# Altium project STM32U575-refrence.PrjPcb
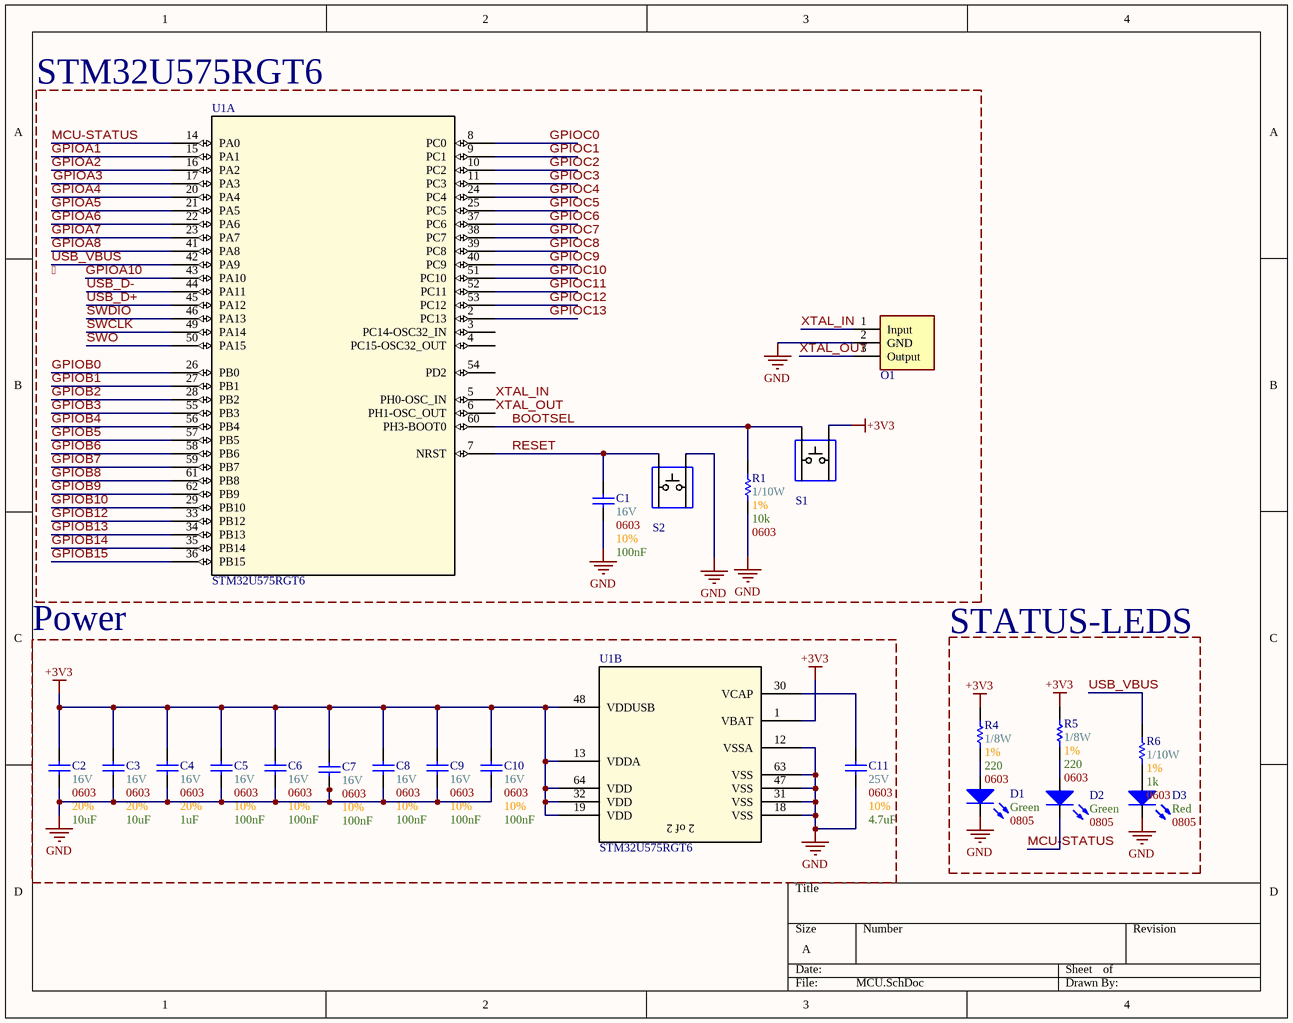
[diagram p0: MCU.SchDoc]
2 sheets, 32 parts. Net scope: global (net labels, ports and power ports of the same name join across sheets).
Board file: STM32 refrence board.PcbDoc
Sheets:
  MCU.SchDoc
  Connectors.SchDoc

## Sheet MCU.SchDoc
size A; SheetNumber: 1; SheetTotal: 2

### Parts
C1  Max Voltage: 16V  Size Package: 0603  Tolerance: 10%  Capacitance: 100nF  [[Cap] SMD 0603]  (hidden comment: [Cap] 0603 0.1uF 10% 16V)
C2  Max Voltage: 16V  Size Package: 0603  Tolerance: 20%  Capacitance: 10uF  [[Cap] SMD 0603]  (hidden comment: [Cap] 0603 10uF 20% 16V)
C3  Max Voltage: 16V  Size Package: 0603  Tolerance: 20%  Capacitance: 10uF  [[Cap] SMD 0603]  (hidden comment: [Cap] 0603 10uF 20% 16V)
C4  Max Voltage: 16V  Size Package: 0603  Tolerance: 20%  Capacitance: 1uF  [[Cap] SMD 0603]  (hidden comment: [Cap] 0603 10uF 20% 16V)
C5  Max Voltage: 16V  Size Package: 0603  Tolerance: 10%  Capacitance: 100nF  [[Cap] SMD 0603]  (hidden comment: [Cap] 0603 0.1uF 10% 16V)
C6  Max Voltage: 16V  Size Package: 0603  Tolerance: 10%  Capacitance: 100nF  [[Cap] SMD 0603]  (hidden comment: [Cap] 0603 0.1uF 10% 16V)
C7  Max Voltage: 16V  Size Package: 0603  Tolerance: 10%  Capacitance: 100nF  [[Cap] SMD 0603]  (hidden comment: [Cap] 0603 0.1uF 10% 16V)
C8  Max Voltage: 16V  Size Package: 0603  Tolerance: 10%  Capacitance: 100nF  [[Cap] SMD 0603]  (hidden comment: [Cap] 0603 0.1uF 10% 16V)
C9  Max Voltage: 16V  Size Package: 0603  Tolerance: 10%  Capacitance: 100nF  [[Cap] SMD 0603]  (hidden comment: [Cap] 0603 0.1uF 10% 16V)
C10  Max Voltage: 16V  Size Package: 0603  Tolerance: 10%  Capacitance: 100nF  [[Cap] SMD 0603]  (hidden comment: [Cap] 0603 0.1uF 10% 16V)
C11  Max Voltage: 25V  Size Package: 0603  Tolerance: 10%  Capacitance: 4.7uF  [[Cap] SMD 0603]  (hidden comment: [Cap] 0603 4.7uF 10% 25V)
D1  Color: Green  Size Package: 0805  [[LED] SMD 0805]  (hidden comment: [LED] SMD 0805 Green)
D2  Color: Green  Size Package: 0805  [[LED] SMD 0805]  (hidden comment: [LED] SMD 0805 Green)
D3  Color: Red  Size Package: 0805  [[LED] SMD 0805]  (hidden comment: [LED] SMD 0805 Red)
O1  XOSC 12MHz  [[Resonator] SMD 12MHz]  (value not drawn)
R1  Wattage: 1/10W  Tolerance: 1%  Resistance: 10k  Size Package: 0603  [[Res] SMD 0603]  (hidden comment: [10k] SMD 0603 1% 1/8W)
R4  Wattage: 1/8W  Tolerance: 1%  Resistance: 220  Size Package: 0603  [[Res] SMD 0603]  (hidden comment: [220] SMD 0603 1% 1/10W)
R5  Wattage: 1/8W  Tolerance: 1%  Resistance: 220  Size Package: 0603  [[Res] SMD 0603]  (hidden comment: [220] SMD 0603 1% 1/10W)
R6  Wattage: 1/10W  Tolerance: 1%  Resistance: 1k  Size Package: 0603  [[Res] SMD 0603]  (hidden comment: [1k] SMD 0603 1% 1/10W)
S1  Standard pushbutton  [[SPST] Pushbutton]  (value not drawn)
S2  Standard pushbutton  [[SPST] Pushbutton]  (value not drawn)
U1  STM32U575RGT6  [LQFP64-10x10mm_STM]  (parts A,B of 2)

### Blocks framed on the sheet
STM32U575RGT6: C1 O1 R1 S1 S2 U1
Power: C2-C11 U1
STATUS-LEDS: D1-D3 R4-R6

### Nets
+3V3: C2.2 C3.2 C4.2 C5.2 C6.2 C7.2 C8.2 C9.2 C10.2 R4.2 R5.2 S1.1 U1.1(VBAT) U1.13(VDDA) U1.19(VDD) U1.32(VDD) U1.48(VDDUSB) U1.64(VDD)
GND: C1.1 C2.1 C3.1 C4.1 C5.1 C6.1 C7.1 C8.1 C9.1 C10.1 C11.1 D1.2(Cathode) D3.2(Cathode) O1.2(GND) R1.1 S2.1 U1.12(VSSA) U1.18(VSS) U1.31(VSS) U1.47(VSS) U1.63(VSS)
BOOTSEL: R1.2 S1.2 U1.60(PH3-BOOT0)
GPIOA1: U1.15(PA1)
GPIOA2: U1.16(PA2)
GPIOA3: U1.17(PA3)
GPIOA4: U1.20(PA4)
GPIOA5: U1.21(PA5)
GPIOA6: U1.22(PA6)
GPIOA7: U1.23(PA7)
GPIOA8: U1.41(PA8)
GPIOA10: U1.43(PA10)
GPIOB0: U1.26(PB0)
GPIOB1: U1.27(PB1)
GPIOB2: U1.28(PB2)
GPIOB3: U1.55(PB3)
GPIOB4: U1.56(PB4)
GPIOB5: U1.57(PB5)
GPIOB6: U1.58(PB6)
GPIOB7: U1.59(PB7)
GPIOB8: U1.61(PB8)
GPIOB9: U1.62(PB9)
GPIOB10: U1.29(PB10)
GPIOB12: U1.33(PB12)
GPIOB13: U1.34(PB13)
GPIOB14: U1.35(PB14)
GPIOB15: U1.36(PB15)
GPIOC0: U1.8(PC0)
GPIOC1: U1.9(PC1)
GPIOC2: U1.10(PC2)
GPIOC3: U1.11(PC3)
GPIOC4: U1.24(PC4)
GPIOC5: U1.25(PC5)
GPIOC6: U1.37(PC6)
GPIOC7: U1.38(PC7)
GPIOC8: U1.39(PC8)
GPIOC9: U1.40(PC9)
GPIOC10: U1.51(PC10)
GPIOC11: U1.52(PC11)
GPIOC12: U1.53(PC12)
GPIOC13: U1.2(PC13)
MCU-STATUS: D2.2(Cathode) U1.14(PA0)
RESET: C1.2 S2.2 U1.7(NRST)
SWCLK: U1.49(PA14)
SWDIO: U1.46(PA13)
SWO: U1.50(PA15)
USB_D+: U1.45(PA12)
USB_D-: U1.44(PA11)
USB_VBUS: R6.2 U1.42(PA9)
XTAL_IN: O1.1(Input) U1.5(PH0-OSC_IN)
XTAL_OUT: O1.3(Output) U1.6(PH1-OSC_OUT)
NetC11_2: C11.2 U1.30(VCAP)
NetD1_1: D1.1(Anode) R4.1
NetD2_1: D2.1(Anode) R5.1
NetD3_1: D3.1(Anode) R6.1

Not connected (* = marked no-connect by the designer): U1 3(PC14-OSC32_IN) 4(PC15-OSC32_OUT) 54(PD2)

### Notes on the sheet
- Labels drawn without touching a wire or pin: 
- (in symbol CMP-031-00064-2, part B) 2 of 2

### Library data of the parts
C1 C5-C10 = [Cap] 0603 0.1uF 10% 16V: CC0603KRX7R7BB104; Supplier 1: DigiKey; Supplier Part Number 1: 311-1088-6-ND
C2-C4 = [Cap] 0603 10uF 20% 16V: GRM188C81C106MA73D; Supplier 1: DigiKey; Supplier Part Number 1: 490-7198-1-ND
C11 = [Cap] 0603 4.7uF 10% 25V: GRM188R61E475KE11D; Supplier 1: DigiKey; Supplier Part Number 1: 490-7203-6-ND
D1 D2 = [LED] SMD 0805 Green: LG R971-KN-1-0-20-R18; Supplier 1: DigiKey; Supplier Part Number 1: 475-LGR971-KN-1CT-ND
D3 = [LED] SMD 0805 Red: LS R976-NR-1-0-20-R18; Supplier 1: DigiKey; Supplier Part Number 1: 475-LSR976-NR-1CT-ND
O1 = [Resonator] SMD 12MHz: CSTNE12M0GH5L000R0; Supplier 1: DigiKey; Supplier Part Number 1: 490-17947-1-ND
R1 = [10k] SMD 0603 1% 1/8W: RMCF0603FT10K0; Supplier 1: DigiKey; Supplier Part Number 1: RMCF0603FT10K0DKR-ND
R4 R5 = [220] SMD 0603 1% 1/10W: CRGCQ0805F220R; Supplier 1: DigiKey; Supplier Part Number 1: A129741CT-ND
R6 = [1k] SMD 0603 1% 1/10W: RMCF0603FT1K00; Supplier 1: DigiKey; Supplier Part Number 1: RMCF0603FT1K00DKR-ND
S1 S2 = [SPST] Pushbutton: Supplier 1: DigiKey; Supplier Part Number 1: 450-1650-ND
U1 = CMP-031-00064-2: Ultra-low-power with FPU Arm Cortex-M33 MCU with TrustZone, 160 MHz with 1 Mbyte of Flash memory; Manufacturer_Name: STMicroelectronics; Source: STM32U575RGT6.SchLib; Component Type: Standard; Manufacturer_Part_Number: STM32U575RGT6; Pins: 64; Design Item ID: STM32U575RGT6; RefDes: RefDes; Type: Type; Datasheet: https://www.st.com/resource/en/datasheet/stm32u575ag.pdf; Copyright: Copyright (C) 2025 Ultra Librarian. All rights reserved.

## Sheet Connectors.SchDoc
size B; SheetNumber: 2; SheetTotal: 2
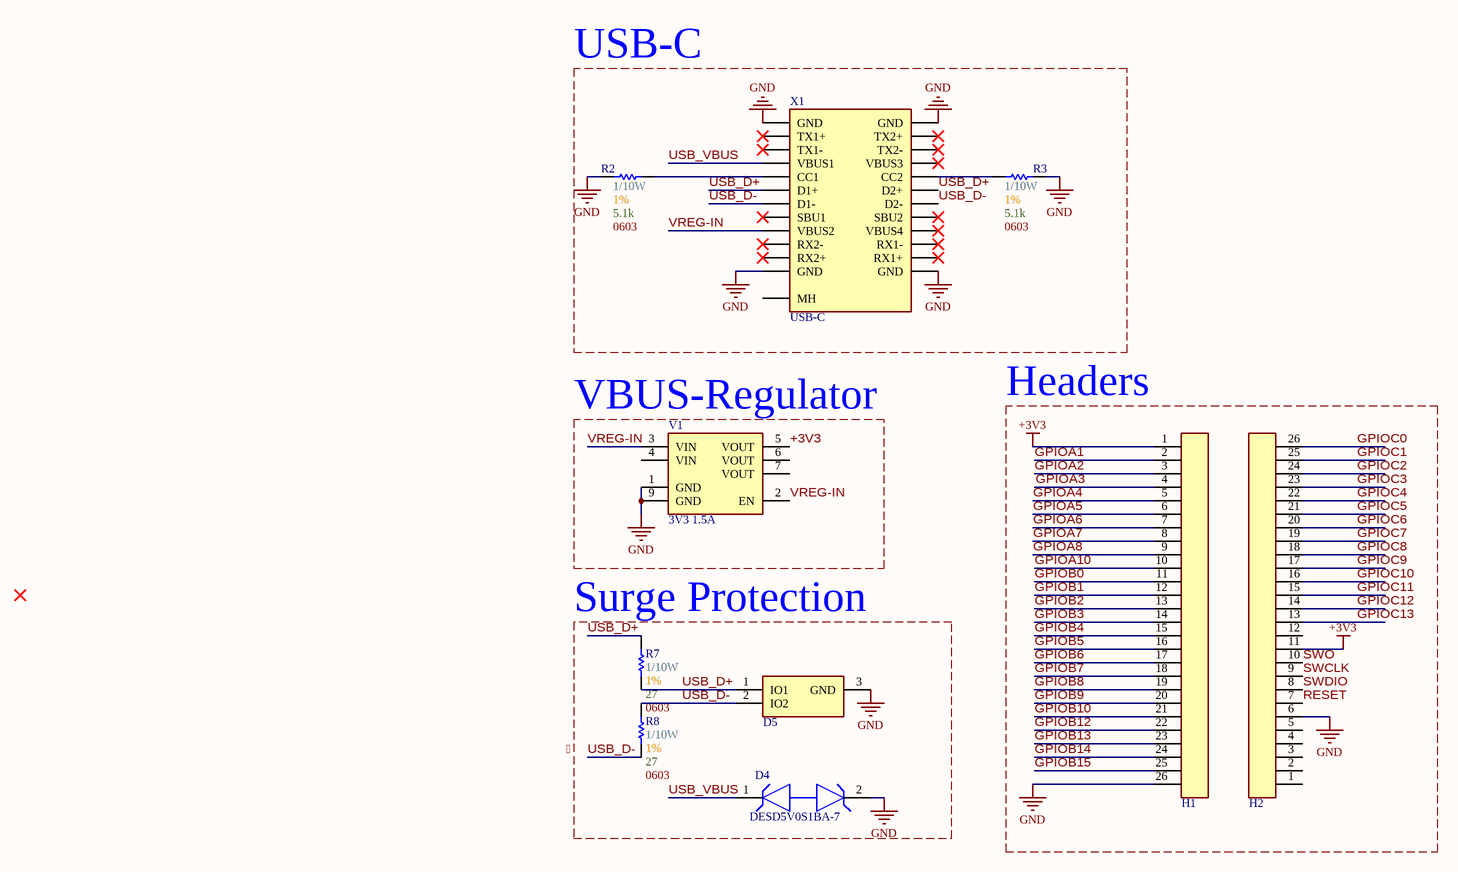
[diagram p1: Connectors.SchDoc]

### Parts
D4  DESD5V0S1BA-7  [FP-SOD323-MFG]
D5  TPD2E2U06QDBZRQ1  [SOT95P237X95-3N]  (value not drawn)
H1  1x26 Header  [[Header] 1x26 Male]  (value not drawn)
H2  1x26 Header  [[Header] 1x26 Male]  (value not drawn)
R2  Wattage: 1/10W  Tolerance: 1%  Resistance: 5.1k  Size Package: 0603  [[Res] SMD 0603]  (hidden comment: [5.1k] SMD 0603 1% 1/10W)
R3  Wattage: 1/10W  Tolerance: 1%  Resistance: 5.1k  Size Package: 0603  [[Res] SMD 0603]  (hidden comment: [5.1k] SMD 0603 1% 1/10W)
R7  Wattage: 1/10W  Tolerance: 1%  Resistance: 27  Size Package: 0603  [[Res] SMD 0603]  (hidden comment: [27] SMD 0603 1% 1/10W)
R8  Wattage: 1/10W  Tolerance: 1%  Resistance: 27  Size Package: 0603  [[Res] SMD 0603]  (hidden comment: [27] SMD 0603 1% 1/10W)
V1  3V3 1.5A  [[Linear] 3V3 1.5A]
X1  USB-C  [[USB] USB-C Right-Angle]

### Blocks framed on the sheet
USB-C: R2 R3 X1
VBUS-Regulator: V1
Headers: H1 H2
Surge Protection: D4 D5 R7 R8

### Nets
+3V3: H1.1 H2.11 V1.5(VOUT)
GND: D4.2 D5.3(GND) H1.26 H2.6 R2.1 R3.2 V1.1(GND) V1.9(GND) X1.A1(GND) X1.A12(GND) X1.B1(GND) X1.B12(GND)
GPIOA1: H1.2
GPIOA2: H1.3
GPIOA3: H1.4
GPIOA4: H1.5
GPIOA5: H1.6
GPIOA6: H1.7
GPIOA7: H1.8
GPIOA8: H1.9
GPIOA10: H1.10
GPIOB0: H1.11
GPIOB1: H1.12
GPIOB2: H1.13
GPIOB3: H1.14
GPIOB4: H1.15
GPIOB5: H1.16
GPIOB6: H1.17
GPIOB7: H1.18
GPIOB8: H1.19
GPIOB9: H1.20
GPIOB10: H1.21
GPIOB12: H1.22
GPIOB13: H1.23
GPIOB14: H1.24
GPIOB15: H1.25
GPIOC0: H2.26
GPIOC1: H2.25
GPIOC2: H2.24
GPIOC3: H2.23
GPIOC4: H2.22
GPIOC5: H2.21
GPIOC6: H2.20
GPIOC7: H2.19
GPIOC8: H2.18
GPIOC9: H2.17
GPIOC10: H2.16
GPIOC11: H2.15
GPIOC12: H2.14
GPIOC13: H2.13
RESET: H2.7
SWCLK: H2.9
SWDIO: H2.8
SWO: H2.10
USB_D+: D5.1(IO1) R7.1 R7.2 X1.A6(D1+) X1.B6(D2+)
USB_D-: D5.2(IO2) R8.1 R8.2 X1.A7(D1-) X1.B7(D2-)
USB_VBUS: D4.1 X1.A4(VBUS1)
VREG-IN: V1.2(EN) V1.3(VIN) X1.A9(VBUS2)
NetR2_2: R2.2 X1.A5(CC1)
NetR3_1: R3.1 X1.B5(CC2)

Not connected (* = marked no-connect by the designer): H2 1 2 3 4 5 12; V1 4(VIN) 6(VOUT) 7(VOUT); X1 A2(TX1+)* A3(TX1-)* A8(SBU1)* A10(RX2-)* A11(RX2+)* B2(TX2+)* B3(TX2-)* B4(VBUS3)* B8(SBU2)* B9(VBUS4)* B10(RX1-)* B11(RX1+)* MH

### Notes on the sheet
- Labels drawn without touching a wire or pin: 

### Library data of the parts
D4 = CMP-12828-000011-1: TVS DIODE 5V 14V SOD323; Manufacturer: Diodes Inc; Capacitance: 35pF; Direction: Bidirectional; Breakdown Voltage: 5.5V; Number Of Channels: 1; Standoff Height: 0.05mm; Max Junction Temp: +150°C; Peak Pulse Current: 12A; Value: 35pF; Peak Pulse Power: 130W; ComponentLink2Description: Datasheet; Manufacturer Part Number: DESD5V0S1BA-7; Mouser Description: TVS Diodes / ESD Suppressors Low Cap BI TVS Diode 130W 12A 200mW; Digikey Description: TVS DIODE 5V 14V SOD323; Temperature: -65°C to +150°C; Clamping Voltage: 14V; Device Class L2: TVS Diodes; Temperature Range Low: -65°C; Octopart: https://octopart.com/desd5v0s1ba-7-diodes+inc.-23272867; Lead Free: Yes; Package: SOD323; Temperature Range High: +150°C; Automotive: No; Device Class L1: Circuit Protection; RoHS: TRUE; Height: 1.2mm; Reverse Standoff Voltage: 5V; Category: Diode; Device Class L3: unset; ComponentLink2URL: https://www.diodes.com/assets/Datasheets/ds31275.pdf
D5 = CMP-018-000010-3: USB ESD Protection; Manufacturer_Name: Texas Instruments; Arrow Price/Stock: https://www.arrow.com/en/products/tpd2e2u06qdbzrq1/texas-instruments?region=nac; Datasheet Link: http://www.ti.com/lit/gpn/tpd2e2u06-q1; Arrow Part Number: TPD2E2U06QDBZRQ1; Design Item ID: TPD2E2U06QDBZRQ1; Mouser Price/Stock: https://www.mouser.co.uk/ProductDetail/Texas-Instruments/TPD2E2U06QDBZRQ1?qs=ADSrZYdIRCdCCkTjX0u0BA%3D%3D; Mouser Part Number: 595-TPD2E2U06QDBZRQ1; Source: SamacSys.SchLib; Manufacturer_Part_Number: TPD2E2U06QDBZRQ1; Height: 0.95mm
H1 H2 = [Header] 1x26 Male: 2.54mm pitch
R2 R3 = [5.1k] SMD 0603 1% 1/10W: RC0603FR-075K1L; Supplier 1: DigiKey; Supplier Part Number 1: 311-5.10KHRCT-ND
R7 R8 = [27] SMD 0603 1% 1/10W: MCT06030C2709FP500; Supplier 1: DigiKey; Supplier Part Number 1: 749-1631-1-ND
V1 = [Linear] 3V3 1.5A: AP7362A-33SP-13; Supplier 1: DigiKey; Supplier Part Number 1: AP7362A-33SP-13DICT-ND
X1 = [USB] Type-C Right-Angle: Supplier 1: DigiKey; Supplier Part Number 1: 670-3104-1-ND

## Nets that join several sheets
+3V3: MCU (18 pins), Connectors (H1.1 H2.11 V1.5)
GND: MCU (21 pins), Connectors (12 pins)
GPIOA1: MCU (U1.15), Connectors (H1.2)
GPIOA2: MCU (U1.16), Connectors (H1.3)
GPIOA3: MCU (U1.17), Connectors (H1.4)
GPIOA4: MCU (U1.20), Connectors (H1.5)
GPIOA5: MCU (U1.21), Connectors (H1.6)
GPIOA6: MCU (U1.22), Connectors (H1.7)
GPIOA7: MCU (U1.23), Connectors (H1.8)
GPIOA8: MCU (U1.41), Connectors (H1.9)
GPIOA10: MCU (U1.43), Connectors (H1.10)
GPIOB0: MCU (U1.26), Connectors (H1.11)
GPIOB1: MCU (U1.27), Connectors (H1.12)
GPIOB2: MCU (U1.28), Connectors (H1.13)
GPIOB3: MCU (U1.55), Connectors (H1.14)
GPIOB4: MCU (U1.56), Connectors (H1.15)
GPIOB5: MCU (U1.57), Connectors (H1.16)
GPIOB6: MCU (U1.58), Connectors (H1.17)
GPIOB7: MCU (U1.59), Connectors (H1.18)
GPIOB8: MCU (U1.61), Connectors (H1.19)
GPIOB9: MCU (U1.62), Connectors (H1.20)
GPIOB10: MCU (U1.29), Connectors (H1.21)
GPIOB12: MCU (U1.33), Connectors (H1.22)
GPIOB13: MCU (U1.34), Connectors (H1.23)
GPIOB14: MCU (U1.35), Connectors (H1.24)
GPIOB15: MCU (U1.36), Connectors (H1.25)
GPIOC0: MCU (U1.8), Connectors (H2.26)
GPIOC1: MCU (U1.9), Connectors (H2.25)
GPIOC2: MCU (U1.10), Connectors (H2.24)
GPIOC3: MCU (U1.11), Connectors (H2.23)
GPIOC4: MCU (U1.24), Connectors (H2.22)
GPIOC5: MCU (U1.25), Connectors (H2.21)
GPIOC6: MCU (U1.37), Connectors (H2.20)
GPIOC7: MCU (U1.38), Connectors (H2.19)
GPIOC8: MCU (U1.39), Connectors (H2.18)
GPIOC9: MCU (U1.40), Connectors (H2.17)
GPIOC10: MCU (U1.51), Connectors (H2.16)
GPIOC11: MCU (U1.52), Connectors (H2.15)
GPIOC12: MCU (U1.53), Connectors (H2.14)
GPIOC13: MCU (U1.2), Connectors (H2.13)
RESET: MCU (C1.2 S2.2 U1.7), Connectors (H2.7)
SWCLK: MCU (U1.49), Connectors (H2.9)
SWDIO: MCU (U1.46), Connectors (H2.8)
SWO: MCU (U1.50), Connectors (H2.10)
USB_D+: MCU (U1.45), Connectors (5 pins)
USB_D-: MCU (U1.44), Connectors (5 pins)
USB_VBUS: MCU (R6.2 U1.42), Connectors (D4.1 X1.A4)